# EasyEDA Pro project CheeseCake-BMI270-RV.epro

# Schematic BMI270-RV
Create Date: 2024-04-08; Page Name: BMI270; Project Name: 芝士蛋糕模块板; Schematic Name: BMI270-RV; Update Date: 2024-04-08; Company: Designed bg SoraKage; Page Size: A4; Version: V2.3
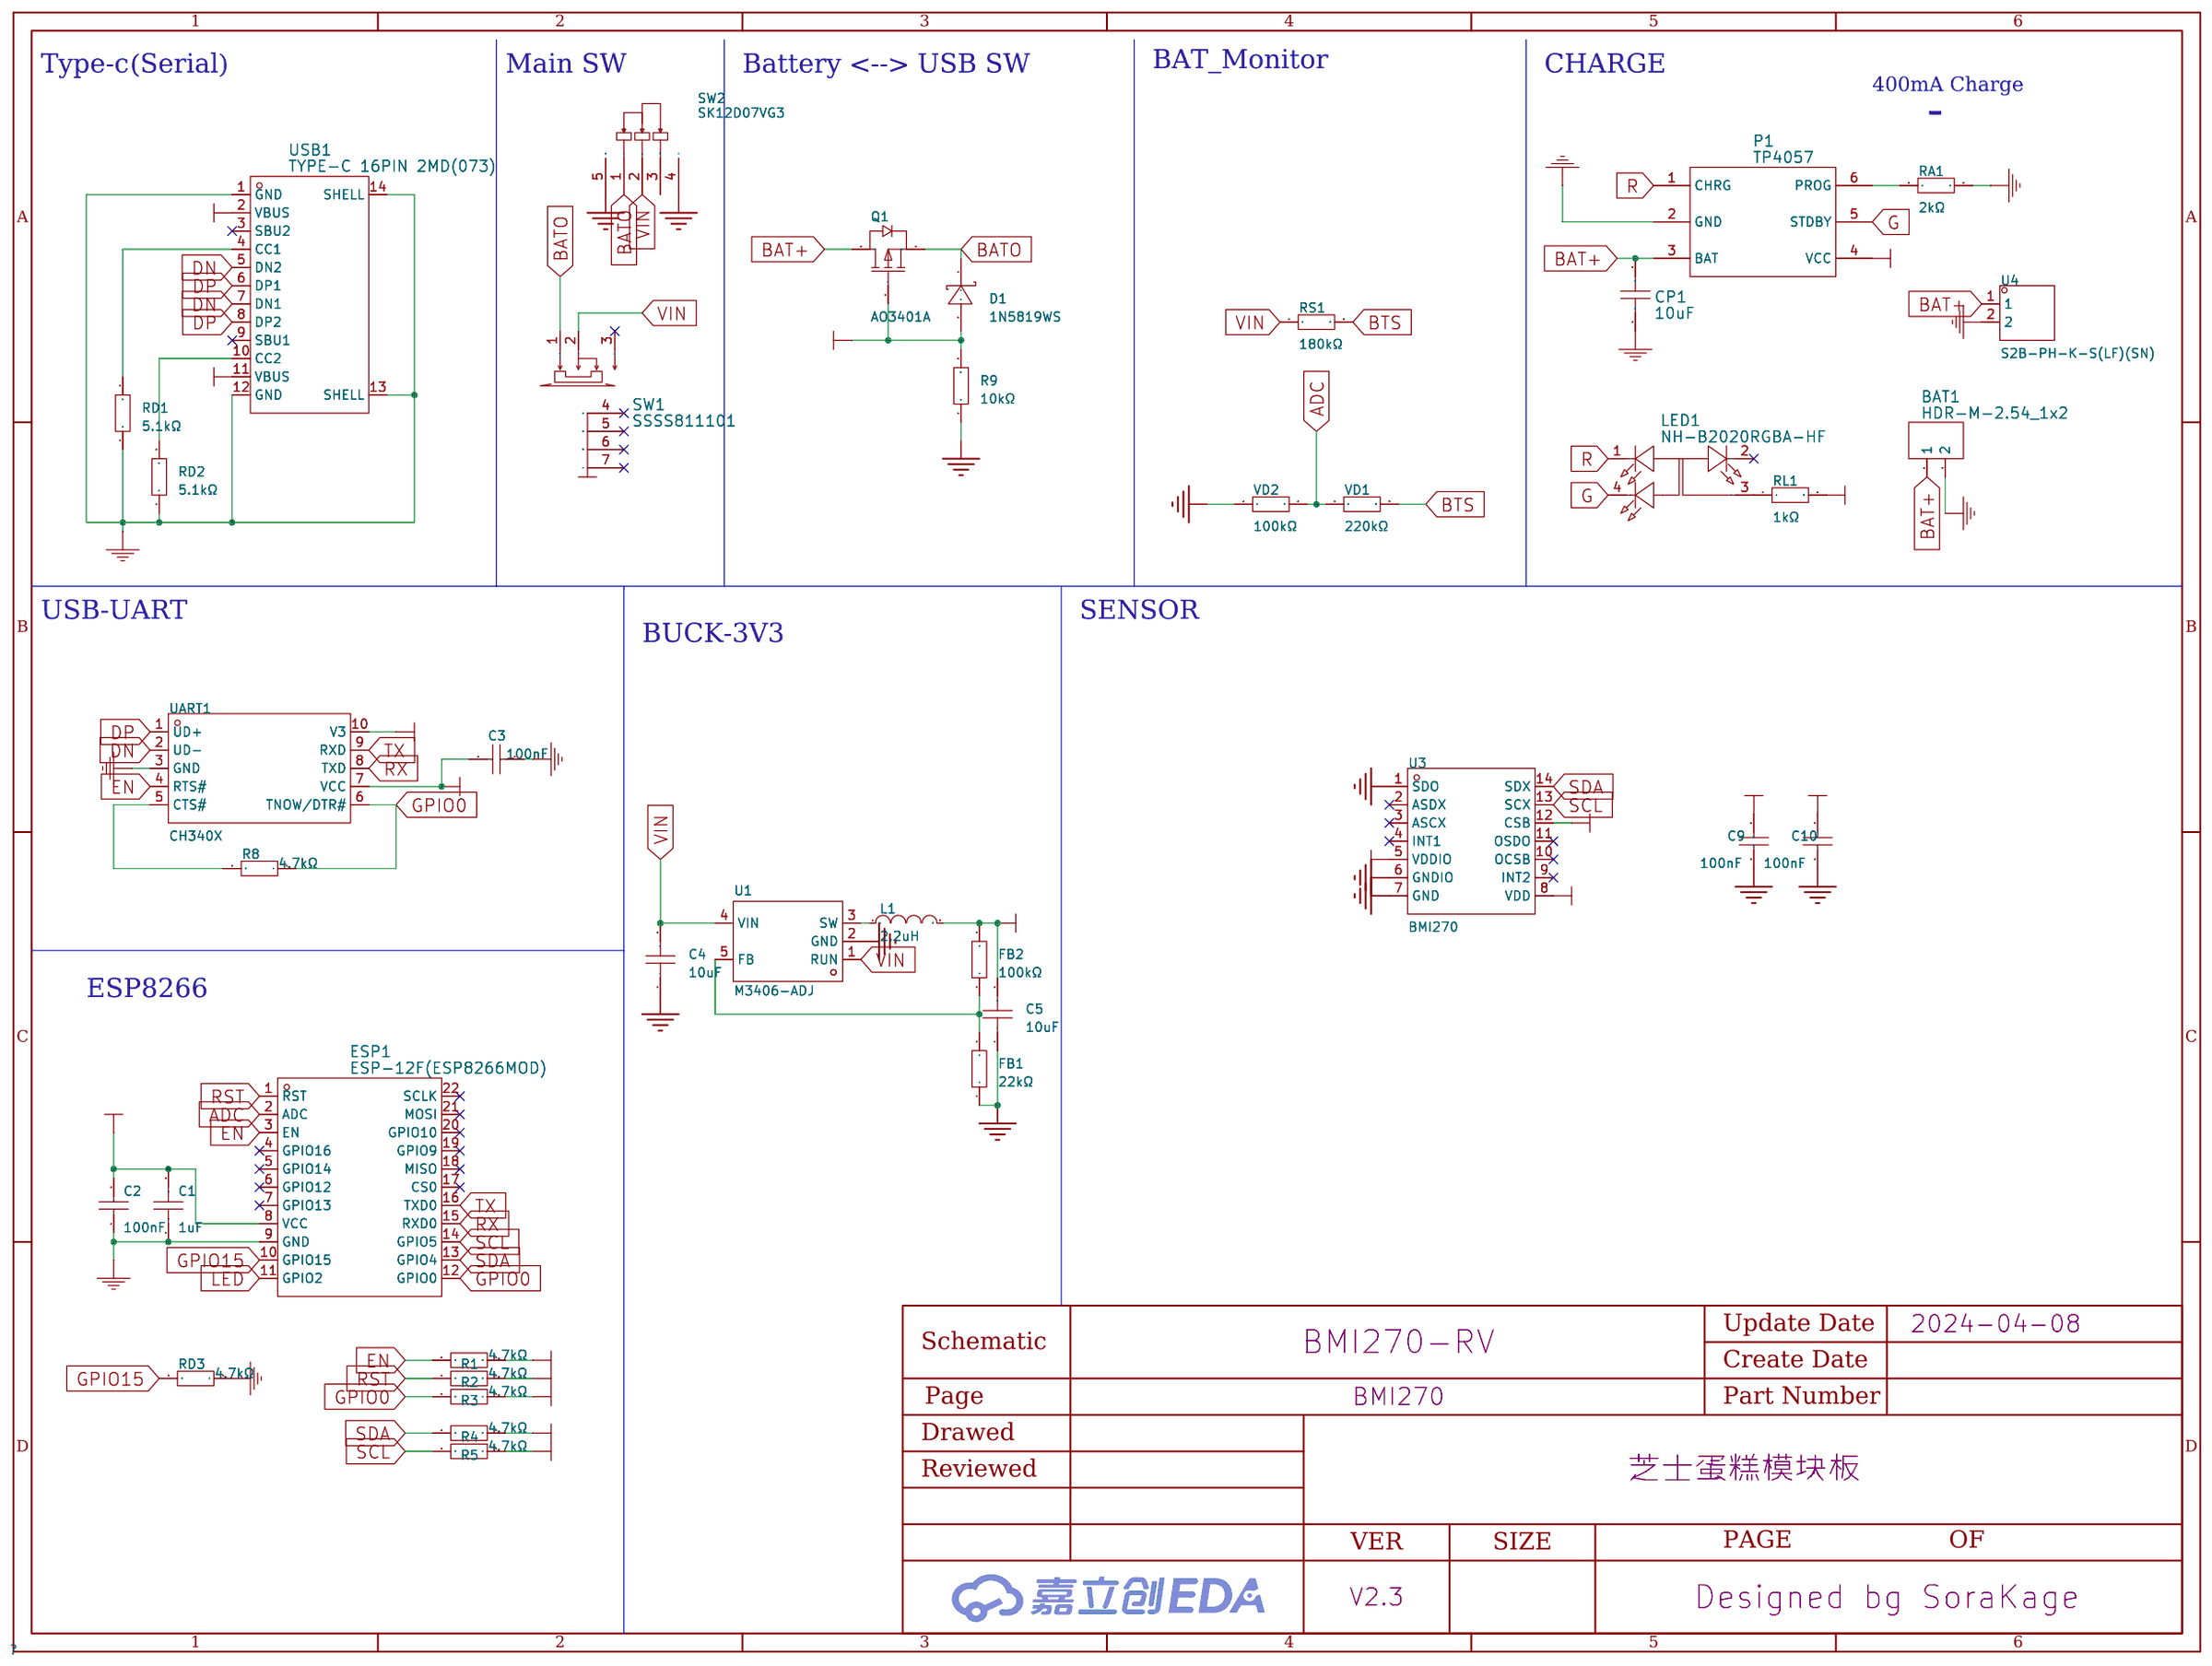
[diagram p0: schematic sheet]

## Parts
BAT1  HDR-M-2.54_1x2  [HDR-M-2.54_1X2]
C1  1uF  [C0402]
C2  100nF  [C0402]
C3  100nF  [C0402]
C4  10uF  [C0603]
C5  10uF  [C0603]
C9  100nF  [C0402]
C10  100nF  [C0402]
CP1  10uF  [C0603]
D1  1N5819WS  [SOD-323_L1.8-W1.3-LS2.5-RD]
ESP1  ESP-12F(ESP8266MOD)  [WIFIM-SMD_ESP-12F-ESP8266MOD]
FB1  22kΩ  [R0402]
FB2  100kΩ  [R0402]
L1  2.2uH  [IND-SMD_L2.5-W2.0_YXMBL252010P]
LED1  NH-B2020RGBA-HF  [LED-ARRAY-SMD_4P-L2.1-W2.1-TL_NH-B2020RGBA]
P1  TP4057  [SOT-23-6_L2.9-W1.6-P0.95-LS2.8-BL]
Q1  AO3401A  [SOT-23_L2.9-W1.3-P1.90-LS2.4-BR]
R1  4.7kΩ  [R0402]
R2  4.7kΩ  [R0402]
R3  4.7kΩ  [R0402]
R4  4.7kΩ  [R0402]
R5  4.7kΩ  [R0402]
R8  4.7kΩ  [R0402]
R9  10kΩ  [R0402]
RA1  2kΩ  [R0402]
RD1  5.1kΩ  [R0402]
RD2  5.1kΩ  [R0402]
RD3  4.7kΩ  [R0402]
RL1  1kΩ  [R0402]
RS1  180kΩ  [R0402]
SW1  SSSS811101  [SW-SMD_SSSS811101]
SW2  SK12D07VG3  [SW-TH_SK12D07VG3]
U1  M3406-ADJ  [SOT-23-5_L3.0-W1.7-P0.95-LS2.8-BR]
U3  BMI270  [LGA-14_L3.0-W2.5-P0.50-BR]
U4  S2B-PH-K-S(LF)(SN)  [CONN-TH_S2B-PH-K-S-LF-SN]
UART1  CH340X  [MSOP-10_L3.0-W3.0-P0.50-LS5.0-BL]
USB1  TYPE-C 16PIN 2MD(073)  [USB-C-SMD_TYPE-C-6PIN-2MD-073]
VD1  220kΩ  [R0402]
VD2  100kΩ  [R0402]

## Library data of the parts
BAT1 = HDR-M-2.54_1x2: Supplier Part: C124375; Supplier: LCSC
C1 = CL05A105KA5NQNC: 容值:1uF;精度:±10%;额定电压:25V;材质(温度系数):X5R;; LCSC Part Name: 1uF ±10% 25V; Supplier Part: C52923; Manufacturer: SAMSUNG(三星); Supplier Footprint: 0402; JLCPCB Part Class: 基础库; Datasheet: https://atta.szlcsc.com/upload/public/pdf/source/20160103/1457707735223.pdf; Supplier: LCSC; Tolerance: ±10%; Voltage Rated: 25V; Temperature Coefficient: X5R
C2 C3 C9 C10 = CL05B104KO5NNNC: 容值:100nF;精度:±10%;额定电压:16V;材质(温度系数):X7R;; LCSC Part Name: 100nF ±10% 16V; Supplier Part: C1525; Manufacturer: SAMSUNG(三星); Supplier Footprint: 0402; JLCPCB Part Class: Basic Part; Datasheet: https://atta.szlcsc.com/upload/public/pdf/source/20160103/1457707674891.pdf; Supplier: LCSC; Tolerance: ±10%; Voltage Rated: 16V; Temperature Coefficient: X7R
C4 C5 = CL10A106KP8NNNC: 容值:10uF;精度:±10%;额定电压:10V;材质(温度系数):X5R;; LCSC Part Name: 10uF ±10% 10V; Supplier Part: C19702; Manufacturer: SAMSUNG(三星); Supplier Footprint: 0603; JLCPCB Part Class: 基础库; Datasheet: https://atta.szlcsc.com/upload/public/pdf/source/20160103/1457707703378.pdf; Supplier: LCSC; Tolerance: ±10%; Voltage Rated: 10V; Temperature Coefficient: X5R
CP1 = 10uF: link: https://item.szlcsc.com/362304.html; 3DModel: C0603_L1.6-W0.8-H0.8; Supplier: LCSC; Manufacturer: SAMSUNG(三星); Manufacturer Part: CL10A106KP8NNNC; Supplier Part: C19702; JLCPCB Part Class: Basic Part
D1 = 1N5819WS_C191023: 直流反向耐压(Vr):40V;平均整流电流(Io):1A;正向压降(Vf):600mV@1A;; LCSC Part Name: 40V 1A 600mV@1A; Supplier Part: C191023; Manufacturer: Hottech(合科泰); Supplier Footprint: SOD-323; JLCPCB Part Class: 基础库; Datasheet: https://atta.szlcsc.com/upload/public/pdf/source/20220428/3CB86FD8D28D653594B4E35F9D5AEFD9.pdf; Supplier: LCSC; Reverse Voltage (Vr): 40V; Average Rectified Current (Io): 1A; Forward Voltage (Vf@If): 600mV@1A
ESP1 = ESP-12F(ESP8266MOD): Supplier: LCSC; Manufacturer: Ai-Thinker; Supplier Part: C82891; JLCPCB Part Class: Extended Part
FB1 = 0402WGF2202TCE: 电阻类型:厚膜电阻;阻值:22kΩ;精度:±1%;功率:62.5mW;; LCSC Part Name: 22kΩ ±1% 62.5mW; Supplier Part: C25768; Manufacturer: UNI-ROYAL(厚声); Supplier Footprint: 0402; JLCPCB Part Class: 基础库; Datasheet: https://atta.szlcsc.com/upload/public/pdf/source/20200306/C422600_1E6D84923E4A46A82E41ADD87F860B5C.pdf; Supplier: LCSC; Type: 厚膜电阻; Tolerance: ±1%; Power(Watts): 62.5mW; Temperature Coefficient: ±100ppm/℃; Overload Voltage (Max): 50V; Operating Temperature Range: -55℃~+155℃
FB2 VD2 = 0402WGF1003TCE: 电阻类型:厚膜电阻;阻值:100kΩ;精度:±1%;功率:62.5mW;; LCSC Part Name: 100kΩ ±1% 62.5mW; Supplier Part: C25741; Manufacturer: UNI-ROYAL(厚声); Supplier Footprint: 0402; JLCPCB Part Class: 基础库; Datasheet: https://atta.szlcsc.com/upload/public/pdf/source/20200306/C422600_1E6D84923E4A46A82E41ADD87F860B5C.pdf; Supplier: LCSC; Type: 厚膜电阻; Tolerance: ±1%; Power(Watts): 62.5mW; Temperature Coefficient: ±100ppm/℃; Overload Voltage (Max): 50V; Operating Temperature Range: -55℃~+155℃
L1 = APH252010T2R2M: 类型:一体成型电感;电感值:2.2uH;精度:±20%;额定电流:2.1A;饱和电流(Isat):3A;; LCSC Part Name: 2.2uH ±20% 3A; Supplier Part: C5349606; Manufacturer: APV(爱普微); Supplier Footprint: L252010; JLCPCB Part Class: 扩展库; Datasheet: https://atta.szlcsc.com/upload/public/pdf/source/20230112/CD71A991BF44148C80048C09E1A9BC6B.pdf; Supplier: LCSC; Type: 一体成型电感; Tolerance: ±20%; Rated Current: 2.1A; Saturation Current (Isat): 3A; DC Resistance (DCR): 70mΩ
LED1 = NH-B2020RGBA-HF: link: https://atta.szlcsc.com/upload/public/pdf/source/20210810/F2CC95523506BC87574AF0308E7F77A3.pdf; Supplier: LCSC; Supplier Part: C2874116; Manufacturer: 国星光电; JLCPCB Part Class: Extended Part
P1 = TP4057-42-SOT26-R: Supplier: LCSC; Manufacturer: TOPPOWER(南京拓微); Supplier Part: C12044; JLCPCB Part Class: Basic Part
Q1 = AO3401A_C15127: 类型:P沟道;漏源电压(Vdss):30V;连续漏极电流(Id):4A;功率(Pd):1.4W;导通电阻(RDS(on)@Vgs,Id):44mΩ@10V,4.3A;; LCSC Part Name: P沟道 30V 4A; Supplier Part: C15127; Manufacturer: AOS; Supplier Footprint: SOT-23-3L; JLCPCB Part Class: 基础库; Datasheet: https://atta.szlcsc.com/upload/public/pdf/source/20160507/1462613609053.pdf; Supplier: LCSC; Type: P沟道; Drain Source Voltage (Vdss): 30V; Continuous Drain Current (Id): 4A; Power Dissipation (Pd): 1.4W; Drain Source On Resistance (RDS(on)@Vgs,Id): 44mΩ@10V,4.3A; Gate Threshold Voltage (Vgs(th)@Id): 1.3V@250uA
R1-R5 R8 RD3 = 0402WGF4701TCE: 电阻类型:厚膜电阻;阻值:4.7kΩ;精度:±1%;功率:62.5mW;; LCSC Part Name: 4.7kΩ ±1% 62.5mW; Supplier Part: C25900; Manufacturer: UNI-ROYAL(厚声); Supplier Footprint: 0402; JLCPCB Part Class: 基础库; Datasheet: https://atta.szlcsc.com/upload/public/pdf/source/20200306/C422600_1E6D84923E4A46A82E41ADD87F860B5C.pdf; Supplier: LCSC; Type: 厚膜电阻; Tolerance: ±1%; Power(Watts): 62.5mW; Temperature Coefficient: ±100ppm/℃; Overload Voltage (Max): 50V; Operating Temperature Range: -55℃~+155℃
R9 = 0402WGF1002TCE: 电阻类型:厚膜电阻;阻值:10kΩ;精度:±1%;功率:62.5mW;; LCSC Part Name: 10kΩ ±1% 62.5mW; Supplier Part: C25744; Manufacturer: UNI-ROYAL(厚声); Supplier Footprint: 0402; JLCPCB Part Class: 基础库; Datasheet: https://atta.szlcsc.com/upload/public/pdf/source/20200306/C422600_1E6D84923E4A46A82E41ADD87F860B5C.pdf; Supplier: LCSC; Type: 厚膜电阻; Tolerance: ±1%; Power(Watts): 62.5mW; Temperature Coefficient: ±100ppm/℃; Overload Voltage (Max): 50V; Operating Temperature Range: -55℃~+155℃
RA1 = 0402WGF2001TCE: 电阻类型:厚膜电阻;阻值:2kΩ;精度:±1%;功率:62.5mW;; LCSC Part Name: 2kΩ ±1% 62.5mW; Supplier Part: C4109; Manufacturer: UNI-ROYAL(厚声); Supplier Footprint: 0402; JLCPCB Part Class: 基础库; Datasheet: https://atta.szlcsc.com/upload/public/pdf/source/20200306/C422600_1E6D84923E4A46A82E41ADD87F860B5C.pdf; Supplier: LCSC; Type: 厚膜电阻; Tolerance: ±1%; Power(Watts): 62.5mW; Temperature Coefficient: ±100ppm/℃; Overload Voltage (Max): 50V; Operating Temperature Range: -55℃~+155℃
RD1 RD2 = 0402WGF5101TCE: 电阻类型:厚膜电阻;阻值:5.1kΩ;精度:±1%;功率:62.5mW;; LCSC Part Name: 5.1kΩ ±1% 62.5mW; Supplier Part: C25905; Manufacturer: UNI-ROYAL(厚声); Supplier Footprint: 0402; JLCPCB Part Class: 基础库; Datasheet: https://atta.szlcsc.com/upload/public/pdf/source/20200306/C422600_1E6D84923E4A46A82E41ADD87F860B5C.pdf; Supplier: LCSC; Type: 厚膜电阻; Tolerance: ±1%; Power(Watts): 62.5mW; Temperature Coefficient: ±100ppm/℃; Overload Voltage (Max): 50V; Operating Temperature Range: -55℃~+155℃
RL1 = 0402WGF1001TCE: 电阻类型:厚膜电阻;阻值:1kΩ;精度:±1%;功率:62.5mW;; LCSC Part Name: 1kΩ ±1% 62.5mW; Supplier Part: C11702; Manufacturer: UNI-ROYAL(厚声); Supplier Footprint: 0402; JLCPCB Part Class: 基础库; Datasheet: https://atta.szlcsc.com/upload/public/pdf/source/20200306/C422600_1E6D84923E4A46A82E41ADD87F860B5C.pdf; Supplier: LCSC; Type: 厚膜电阻; Tolerance: ±1%; Power(Watts): 62.5mW; Temperature Coefficient: ±100ppm/℃; Overload Voltage (Max): 50V; Operating Temperature Range: -55℃~+155℃
RS1 = 0402WGF1803TCE: 阻值:180kΩ;精度:±1%;功率:62.5mW;温度系数:±100ppm/℃;电阻类型:厚膜电阻;; LCSC Part Name: 180kΩ ±1% 62.5mW 厚膜电阻; Supplier Part: C25760; Manufacturer: UNI-ROYAL(厚声); Supplier Footprint: 0402; JLCPCB Part Class: 扩展库; Datasheet: https://atta.szlcsc.com/upload/public/pdf/source/20200306/C422600_1E6D84923E4A46A82E41ADD87F860B5C.pdf; Supplier: LCSC; Tolerance: ±1%; Power(Watts): 62.5mW; Overload Voltage (Max): 50V; Temperature Coefficient: ±100ppm/℃; Type: 厚膜电阻; Operating Temperature Range: -55℃~+155℃
SW1 = SSSS811101: link: https://item.szlcsc.com/110556.html; 3DModel: SW-TH_SSSS811101; Supplier: LCSC; Manufacturer: ALPSALPINE(阿尔卑斯阿尔派); Supplier Part: C109335; JLCPCB Part Class: Extended Part
SW2 = SK12D07VG3: 电路结构:单刀双掷;安装方式:侧插;开关颜色:-;额定电流(DC):500mA;额定电压(DC):50V;额定电流(AC):-;额定电压(AC):-;机械寿命:5千次;; LCSC Part Name: 两档位卧式拨动开关,柄长3MM; Supplier Part: C431547; Manufacturer: SHOU HAN(首韩); Supplier Footprint: 插件; JLCPCB Part Class: 扩展库; Datasheet: https://atta.szlcsc.com/upload/public/pdf/source/20190925/C431547_01B93C6F3FA5C09E15F8CCBF4E6DB91A.pdf; Supplier: LCSC; Circuit: 单刀双掷; Pin Style: PC引脚; Switch Length: 8.7mm; Switch Width: 4.4mm; Switch Height: 4.7mm; Mounting Style: 侧插; Current Rating (DC): 500mA; Voltage Rating (DC): 50V; Mechanical Life: 5千次; Operating Temperature: -10℃~+50℃
U1 = M3406-ADJ: 功能类型:降压型;同步整流:-;输出通道数:-;拓扑结构:-;输入电压:-;输出电流(最大值):-;开关频率:-;; LCSC Part Name: 降压型; Supplier Part: C83224; Manufacturer: 西安航天民芯; Supplier Footprint: SOT-23-5; JLCPCB Part Class: 扩展库; Datasheet: https://atta.szlcsc.com/upload/public/pdf/source/20161110/1478742836232.pdf; Supplier: LCSC; Function: 降压型
U3 = BMI270: IMU-惯性测量单元; Supplier Part: C2836813; Manufacturer: Bosch(博世); Supplier Footprint: LGA-14(2.5x3); JLCPCB Part Class: 扩展库; Datasheet: https://atta.szlcsc.com/upload/public/pdf/source/20210625/C2836813_35E1F3F92097F45A3828DF13DDBA01A5.pdf; Supplier: LCSC
U4 = S2B-PH-K-S(LF)(SN): 插针结构:1x2P;间距:2mm;安装方式:弯插;参考系列:PH;总PIN数:2P;排数:1;每排PIN数:2;行距:-;触头材质:黄铜;; LCSC Part Name: 系列:PH 间距:2mm 1x2P; Supplier Part: C173752; Manufacturer: JST; Supplier Footprint: 弯插,P=2mm; JLCPCB Part Class: 扩展库; Datasheet: https://atta.szlcsc.com/upload/public/pdf/source/20181010/C265101_22107ACC4D8714694FDA2DD97145FA81.pdf; Supplier: LCSC; Pins Structure: 1x2P; Pitch: 2mm; Mounting Style: 弯插; Reference Series: PH; Number of Pins: 2P; Number of Rows: 1; Number of PINs Per Row: 2; Contact Material: 黄铜
UART1 = CH340X: Supplier Part: C3035748; Manufacturer: WCH(南京沁恒); Supplier Footprint: MSOP-10; JLCPCB Part Class: Extended Part; Supplier: LCSC
USB1 = TYPE-C 16PIN 2MD(073): link: https://atta.szlcsc.com/upload/public/pdf/source/20210409/C2765186_34D42616F62DF94D17C4D63D74D9FD03.pdf; Supplier: LCSC; Supplier Part: C2765186; Manufacturer: SHOU HAN(首韩); JLCPCB Part Class: Extended Part
VD1 = 0402WGF2203TCE: 电阻类型:厚膜电阻;阻值:220kΩ;精度:±1%;功率:62.5mW;; LCSC Part Name: 220kΩ ±1% 62.5mW; Supplier Part: C25767; Manufacturer: UNI-ROYAL(厚声); Supplier Footprint: 0402; JLCPCB Part Class: 基础库; Datasheet: https://atta.szlcsc.com/upload/public/pdf/source/20200306/C422600_1E6D84923E4A46A82E41ADD87F860B5C.pdf; Supplier: LCSC; Type: 厚膜电阻; Tolerance: ±1%; Power(Watts): 62.5mW; Temperature Coefficient: ±100ppm/℃; Overload Voltage (Max): 50V; Operating Temperature Range: -55℃~+155℃

## Nets
3V3: C1.2 C2.2 C3.2 C5.2 C9.1 C10.1 ESP1.8(VCC) FB2.2 L1.2 R1.1 R2.1 R3.1 R4.1 R5.1 U3.5(VDDIO) U3.8(VDD) U3.12(CSB) UART1.7(VCC) UART1.10(V3)
+5V: D1.2(A) P1.4(VCC) Q1.1(G) R9.2 RL1.2 USB1.2(VBUS) USB1.11(VBUS)
GND: BAT1.2 C1.1 C2.1 C3.1 C4.1 C5.1 C9.2 C10.2 CP1.1 ESP1.9(GND) FB1.1 P1.2(GND) R9.1 RA1.2 RD1.1 RD2.1 RD3.1 SW2.4 SW2.5 U1.2(GND) U3.1(SDO) U3.6(GNDIO) U3.7(GND) U4.2 UART1.3(GND) USB1.1(GND) USB1.12(GND) USB1.13(SHELL) USB1.14(SHELL) VD2.1
VIN: C4.2 RS1.1 SW1.2 SW2.2 U1.1(RUN) U1.4(VIN)
ADC: ESP1.2(ADC) VD1.1 VD2.2
BAT+: BAT1.1 CP1.2 P1.3(BAT) Q1.3(D) U4.1
BATO: D1.1(K) Q1.2(S) SW1.1 SW2.1
BTS: RS1.2 VD1.2
DN: UART1.2(UD-) USB1.5(DN2) USB1.7(DN1)
DP: UART1.1(UD+) USB1.6(DP1) USB1.8(DP2)
EN: ESP1.3(EN) R1.2 UART1.4(RTS#)
G: LED1.4(-) P1.5(STDBY)
GPIO0: ESP1.12(GPIO0) R3.2 R8.1 UART1.6(TNOW/DTR#)
GPIO15: ESP1.10(GPIO15) RD3.2
LED: ESP1.11(GPIO2)
R: LED1.1(-) P1.1(CHRG)
RST: ESP1.1(RST) R2.2
RX: ESP1.15(RXD0) UART1.8(TXD)
SCL: ESP1.14(GPIO5) R5.2 U3.13(SCX)
SDA: ESP1.13(GPIO4) R4.2 U3.14(SDX)
TX: ESP1.16(TXD0) UART1.9(RXD)
$1N2030: RD1.2 USB1.4(CC1)
$1N2031: RD2.2 USB1.10(CC2)
$1N2038: P1.6(PROG) RA1.1
$1N5947: L1.1 U1.3(SW)
$1N5953: FB1.2 FB2.1 U1.5(FB)
$1N6173: R8.2 UART1.5(CTS#)
$1N9979: LED1.3(+) RL1.1

Not connected (* = marked no-connect by the designer): ESP1 4(GPIO16)* 5(GPIO14)* 6(GPIO12)* 7(GPIO13)* 17(CS0)* 18(MISO)* 19(GPIO9)* 20(GPIO10)* 21(MOSI)* 22(SCLK)*; LED1 2(-)*; SW1 3* 4* 5* 6* 7*; SW2 3; U3 2(ASDX)* 3(ASCX)* 4(INT1)* 9(INT2)* 10(OCSB)* 11(OSDO)*; USB1 3(SBU2)* 9(SBU1)*

## Notes on the sheet
- Type-c(Serial)
- Main SW
- Battery <--> USB SW
- BAT_Monitor
- CHARGE
- 400mA Charge
- -
- USB-UART
- SENSOR
- BUCK-3V3
- ESP8266

# Board BMI270-RV
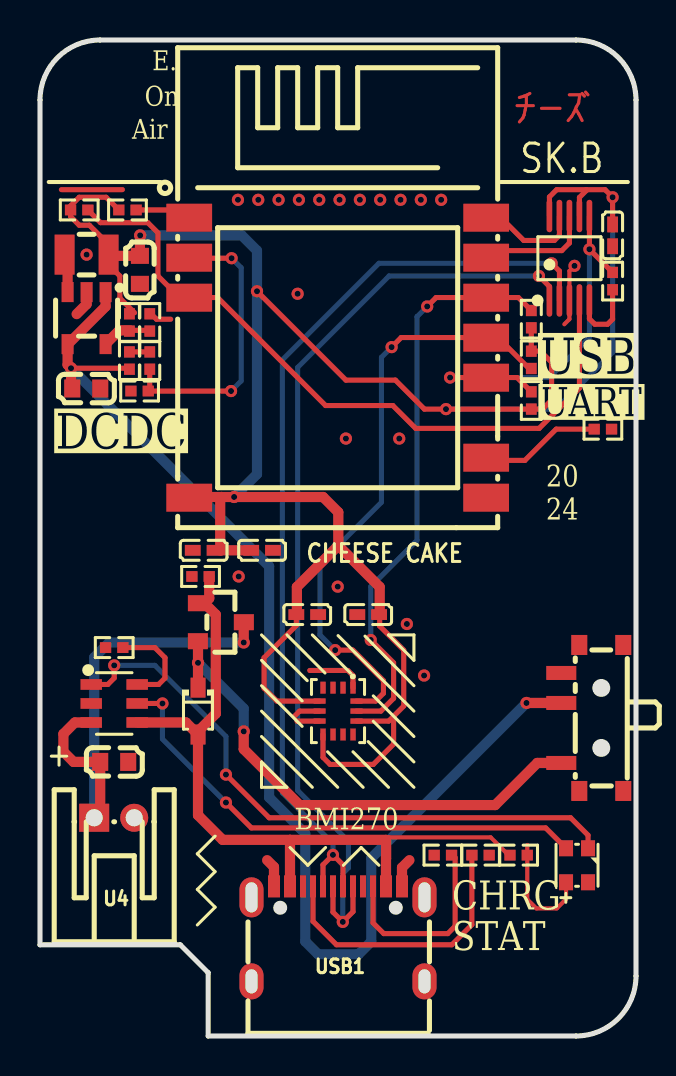
[diagram p1: board, top side]
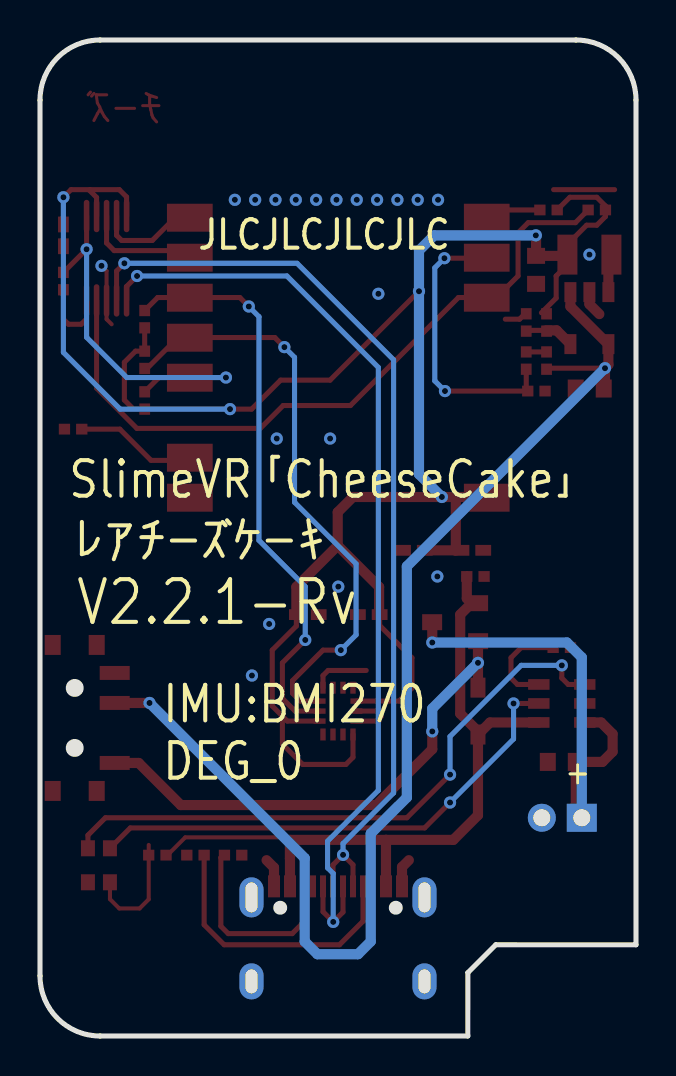
[diagram p2: board, bottom side, seen from below]

Outline 29.8 x 49.8 mm; copper layers: Top Layer, Bottom Layer. Coordinates in mm from the lower left corner of the outline.
Outline path: 0,4.56 0,46.8 arc(0.88,48.92) 3,49.8 26.8,49.8 arc(28.92,48.92) 29.8,46.8 29.8,3 arc(28.92,0.88) 26.8,0 8.41,0 8.41,3.16 7.01,4.56 0,4.56
Stack: Top Layer 0.035mm / Dielectric1 0.91mm FR4 er 4.5 / Bottom Layer 0.035mm

## Design rules (mm)
spacing Default (default): track to track 0.127, other pairs 0 to 0.127
track width Default (default): min 0.127, default 0.127, max 25.4
differential pair differentialPair (default): width min 0.127, default 0.254, max 2.54; gap min 0.152, default 0.152
via Default (default): diameter min 0.61, default 0.61, max 100.025; hole min 0.305, default 0.305, max 59.995
net GND uses gge20888(1)

## Placement (name value [footprint] x y rotation side)
C1  1uF  [C0402]  8.18 24.28 0 top
C2  100nF  [C0402]  11.1 24.28 180 top
C3  100nF  [C0402]  28.63 40.03 90 top
C4  10uF  [C0603]  2.31 32.37 180 top
C5  10uF  [C0603]  5 38.31 90 top
C9  100nF  [C0402]  16.41 21.07 180 top
C10  100nF  [C0402]  13.36 21.07 0 top
CP1  10uF  [C0603]  3.71 13.71 180 top
D1  1N5819WS  [SOD-323_L1.8-W1.3-LS2.5-RD]  7.9 16.25 270 top
ESP1  ESP-12F(ESP8266MOD)  [WIFIM-SMD_ESP-12F-ESP8266MOD]  14.89 33.26 270 top
FB1  22kΩ  [R0402]  5.49 35.68 270 top
FB2  100kΩ  [R0402]  4.47 35.68 90 top
L1  2.2uH  [IND-SMD_L2.5-W2.0_YXMBL252010P]  2.33 39.07 180 top
LED1  NH-B2020RGBA-HF  [LED-ARRAY-SMD_4P-L2.1-W2.1-TL_NH-B2020RGBA]  26.85 8.54 270 top
P1  TP4057  [SOT-23-6_L2.9-W1.6-P0.95-LS2.8-BL]  3.71 16.63 270 top
Q1  AO3401A  [SOT-23_L2.9-W1.3-P1.90-LS2.4-BR]  9.04 20.69 180 top
R1  4.7kΩ  [R0402]  1.96 41.3 0 top
R2  4.7kΩ  [R0402]  4.37 41.3 0 top
R3  4.7kΩ  [R0402]  24.57 31.78 90 top
R4  4.7kΩ  [R0402]  24.57 33.81 270 top
R5  4.7kΩ  [R0402]  24.57 35.84 90 top
R8  4.7kΩ  [R0402]  28.63 37.75 270 top
R9  10kΩ  [R0402]  8.03 22.98 0 top
RA1  2kΩ  [R0402]  3.71 19.42 180 top
RD1  5.1kΩ  [R0402]  22.03 9.04 180 top
RD2  5.1kΩ  [R0402]  20.14 9.04 0 top
RD3  4.7kΩ  [R0402]  28.15 30.34 180 top
RL1  1kΩ  [R0402]  23.93 9.04 180 top
RS1  180kΩ  [R0402]  4.47 33.77 90 top
SW1  SSSS811101  [SW-SMD_SSSS811101]  27.61 15.9 90 top
U1  M3406-ADJ  [SOT-23-5_L3.0-W1.7-P0.95-LS2.8-BR]  2.33 35.89 90 top
U3  BMI270  [LGA-14_L3.0-W2.5-P0.50-BR]  14.9 16.25 90 top
U4  S2B-PH-K-S(LF)(SN)  [CONN-TH_S2B-PH-K-S-LF-SN]  3.71 10.91 180 top
UART1  CH340X  [MSOP-10_L3.0-W3.0-P0.50-LS5.0-BL]  26.47 38.89 0 top
USB1  TYPE-C 16PIN 2MD(073)  [USB-C-SMD_TYPE-C-6PIN-2MD-073]  14.9 5.11 0 top
VD1  220kΩ  [R0402]  5.49 33.77 90 top
VD2  100kΩ  [R0402]  4.98 32.25 0 top

## Footprints (pads in the part's own frame, mm; a bottom-side part is the same pattern mirrored in y, then rotated)
C0402
  rect 0.79x0.54 smd: 1(-0.545,0) 2(0.545,0)
C0603
  rect 0.8x0.9 smd: 1(-0.7,0) 2(0.7,0)
CONN-TH_S2B-PH-K-S-LF-SN
  rect 1.5x1.4 hole 0.85: 1(1,0)
  round 1.4 hole 0.85: 2(-1,0)
IND-SMD_L2.5-W2.0_YXMBL252010P
  rect 1x2 smd: 1(1.1,0) 2(-1.1,0)
LED-ARRAY-SMD_4P-L2.1-W2.1-TL_NH-B2020RGBA
  rect 0.8x0.7 smd: 1(-0.85,0.55) 2(0.85,0.55) 3(0.85,-0.55) 4(-0.85,-0.55)
LGA-14_L3.0-W2.5-P0.50-BR
  rect 0.6x0.27 smd: 1(1.17,-0.75) 2(1.17,-0.25) 3(1.17,0.25) 4(1.17,0.75) 8(-1.17,0.75) 9(-1.17,0.25) 10(-1.17,-0.25) 11(-1.17,-0.75)
  rect 0.27x0.6 smd: 5(0.5,0.92) 6(0,0.92) 7(-0.5,0.92) 12(-0.5,-0.92) 13(0,-0.92) 14(0.5,-0.92)
MSOP-10_L3.0-W3.0-P0.50-LS5.0-BL
  oval 0.28x1.62 smd: 1(-1,-2.11) 2(-0.5,-2.11) 3(0,-2.11) 4(0.5,-2.11) 5(1,-2.11) 6(1,2.11) 7(0.5,2.11) 8(0,2.11) 9(-0.5,2.11) 10(-1,2.11)
R0402
  rect 0.566x0.54 smd: 1(-0.433,0) 2(0.433,0)
SOD-323_L1.8-W1.3-LS2.5-RD
  rect 1x0.75 smd: 1(-1.173,0) 2(1.173,0)
SOT-23-5_L3.0-W1.7-P0.95-LS2.8-BR
  rect 1x0.6 smd: 1(1.3,-0.95) 2(1.3,0) 3(1.3,0.95) 4(-1.3,0.95) 5(-1.3,-0.95)
SOT-23-6_L2.9-W1.6-P0.95-LS2.8-BL
  rect 0.532x1.072 smd: 1(-0.95,-1.149) 2(0,-1.149) 3(0.95,-1.149) 4(0.95,1.149) 5(0,1.149) 6(-0.95,1.149)
SOT-23_L2.9-W1.3-P1.90-LS2.4-BR
  rect 1x0.8 smd: 1(1.15,-0.95) 2(1.15,0.95) 3(-1.15,0)
SW-SMD_SSSS811101
  rect 0.7x1.5 smd: 1(-2.25,1.55) 2(0.75,1.55) 3(2.25,1.55)
  rect 1x0.8 smd: 4(-3.65,0.65) 5(3.65,0.65) 6(3.65,-1.55) 7(-3.65,-1.55)
USB-C-SMD_TYPE-C-6PIN-2MD-073
  rect 0.6x1.1 smd: 1(-3.2,2.375) 2(-2.4,2.375) 11(2.4,2.375) 12(3.2,2.375)
  rect 0.3x1.1 smd: 3(-1.75,2.375) 4(-1.25,2.375) 5(-0.75,2.375) 6(-0.25,2.375) 7(0.25,2.375) 8(0.75,2.375) 9(1.25,2.375) 10(1.75,2.375)
  oval 1.2x2 hole 0.6x1.5: 13(-4.325,1.825) 14(4.325,1.825)
  oval 1.2x1.8 hole 0.6x1.2: 15(-4.325,-2.375) 16(4.325,-2.375)
WIFIM-SMD_ESP-12F-ESP8266MOD
  rect 1.397x2.286 smd: 1(-7.651,-7.425) 2(-5.651,-7.425) 3(-3.651,-7.425) 8(6.349,-7.423) 9(6.349,7.421) 10(4.349,7.423) 12(0.349,7.423) 13(-1.651,7.423) 14(-3.651,7.423) 15(-5.651,7.423) 16(-7.651,7.423)

## Nets
As in the schematic, except:
GND: C1.1 C2.1 C3.1 C4.1 C5.1 C9.2 C10.2 CP1.1 ESP1.9 FB1.1 P1.2 R9.1 RA1.2 RD1.1 RD2.1 RD3.1 U1.2 U3.1 U3.6 U3.7 U4.2 UART1.3 USB1.1 USB1.12 USB1.13 USB1.14 USB1.15 USB1.16 VD2.1

Pads without a net: LED1 2; SW1 3 4 5 6 7; U3 2 3 4 9 10 11; USB1 3 9

## Via types
v1: diameter 0.61, hole 0.305, Top Layer to Bottom Layer, 46 vias

## Routing (per net, layer and track width the routed paths; a pad name or vN(x,y) marks a point on that pad's centre or on a via; arc(x,y) is an arc through that point)
3V3: length 121.5
  Top Layer w0.254: 16.96,21.07 16.98,21.04 16.98,20.5 18.19,19.29 18.19,16.5 17.68,15.99 ; 17.68,15.99 17.68,14.59 16.66,13.58 14.5,13.58 14.15,13.93 U3.8 ; 17.68,15.99 17.43,15.75 15.82,15.75 ; 27.3,42.32 25.84,42.32 25.47,41.95 UART1.10 ; 27.3,42.32 27.33,42.29 26.97,41.93 UART1.7 ; 27.3,42.32 28.25,42.32 v1(28.63,41.94) C3.2 ; R5.1 R4.1 25.02,34.24 25.58,33.68 25.58,31.8 25.13,31.34 R3.1 v1(20.3,31.34) 19.22,31.34 17.77,32.79 15.3,32.79 v1(10.85,37.24) ; 4.73,36.16 3.99,36.89 3.99,38 3.49,38.5 3.49,39.01 ; R2.1 3.31,41.94 1.96,41.94 1.53,41.5 R1.1 1.53,40.97 1.96,40.54 2.47,40.54 3.43,39.58 L1.2 ; C10.1 12.82,20.53 11.2,18.91 11.2,17.39 11.85,16.75 13.98,16.75
  Top Layer w0.508: 14.91,24.52 14.91,26.19 14.15,26.95 v1(9.71,26.95) 9.07,26.95 ; 14.91,24.52 12.84,22.45 12.84,21.1 C10.1 ; 14.91,24.52 16.98,22.45 16.98,21.1 16.96,21.07 ; 9.07,26.95 9.01,26.89 9.01,24.28 10.4,24.28 ; 9.07,26.95 7.45,26.95 7.42,26.92 ; L1.2 3.49,39.01 C5.2 5,40.02 v1(5.01,40.03)
  Bottom Layer w0.254: v1(20.3,31.34) 25.79,31.34 28.63,34.18 v1(28.63,41.94)
  Bottom Layer w0.508: v1(9.71,26.95) 10.85,28.09 v1(10.85,37.24) 10.85,39.27 10.09,40.03 v1(5.01,40.03)
+5V: length 38.7
  Top Layer w0.203: RL1.2 23.42,9.04 22.53,9.93 17.45,9.93 17.45,8.86 17.3,8.86
  Top Layer w0.508: 8.22,21.64 8.79,21.07 8.79,16.12 7.9,15.23 D1.2 ; 8.22,21.64 Q1.1 ; 8.22,21.64 8.46,21.88 R9.2 ; 12.5,9.81 12.5,7.35 ; 12.5,9.81 9.13,9.81 7.9,11.04 D1.2 ; 12.5,9.81 17.3,9.81 17.3,7.35 ; D1.2 7.3,15.68 P1.4
GND: length 17.2
  Top Layer w0.203: 26.22,35.59 26.47,35.84 UART1.3 26.47,38.25 v1(26.73,38.51)
  Top Layer w0.254: 4.12,42.32 1.07,42.32 ; 13.98,16.25 12.98,16.25 12.73,15.99 ; U3.1 15.65,18.02 15.39,18.28 13.49,18.28 ; 6.53,35.84 5.82,35.84 5.52,36.15 ; 12.85,15.74 12.86,15.75 13.98,15.75
  Top Layer w0.508: 11.7,7.35 11.7,8.45 11.36,8.79 ; 18.47,8.79 18.1,8.42 18.1,7.35 ; U1.2 2.33,36.59 1.83,36.09
  vias: v1(2.33,39.07) v1(9.9,41.81) v1(9.93,22.98) v1(10.91,41.81) v1(11.93,41.81) v1(12.95,41.81) v1(12.88,37.11) v1(13.96,41.81) v1(14.89,22.47) v1(14.98,41.81) v1(15.3,29.87) v1(15.99,41.81) v1(17.01,41.81) v1(18.03,41.81) v1(17.96,29.87) v1(18.34,20.6) v1(19.04,41.81) v1(19.2,18.02) v1(20.06,41.81)
VIN: length 62.8
  Top Layer w0.254: RS1.1 4.42,33.39 v1(1.55,33.39)
  Top Layer w0.508: 24.31,16.66 v1(24.32,16.65) SW1.2 ; U1.1 3.28,36.48 1.4,34.59 U1.4 1.38,33.56 v1(1.55,33.39) 1.55,32.56 1.61,32.5
  Bottom Layer w0.508: v1(1.55,33.39) 11.46,23.48 11.46,11.93 13.26,10.12 13.26,4.73 13.9,4.09 15.93,4.09 16.57,4.73 16.57,8.89 v1(24.32,16.65)
ADC: length 14.5
  Top Layer w0.254: 7.42,38.92 7.46,38.89 v1(9.58,38.89) ; v1(9.55,32.25) VD2.2 5.49,32.32 VD1.1
  Bottom Layer w0.254: v1(9.58,38.89) 10.06,38.41 10.06,32.76 v1(9.55,32.25)
BAT+: length 24.3
  Top Layer w0.508: Q1.3 10.19,20.68 v1(10.19,19.67) ; P1.3 1.74,15.68 1.17,15.1 1.17,14.21 1.68,13.71 CP1.2 3.01,11.21 U4.1
  Bottom Layer w0.508: 2.71,10.93 U4.1 2.71,18.93 3.46,19.67 v1(10.19,19.67)
BATO: length 25.4
  Top Layer w0.508: v1(10.19,15.23) 10.19,14.34 12.98,11.55 22.76,11.55 24.87,13.65 SW1.1 ; 7.9,17.54 v1(7.9,18.66) 7.9,19.73 Q1.2
  Bottom Layer w0.508: v1(7.9,18.66) 10.19,16.37 v1(10.19,15.23)
BTS: length 1
  Top Layer w0.254: RS1.2 VD1.2
DN: length 47.1
  Top Layer w0.254: 14.15,7.35 14.15,8.56 v1(14.65,9.06) 15.15,8.55 15.15,7.35 ; UART1.2 25.97,38.25 v1(25.58,38.63)
  Bottom Layer w0.254: v1(25.58,38.63) 16.95,38.63 12.12,33.81 12.12,12.15 14.65,9.63 v1(14.65,9.06)
DP: length 48
  Top Layer w0.254: UART1.1 25.47,37.48 v1(24.95,38) ; 14.65,7.35 14.65,6.19 v1(15.14,5.7) 15.65,6.21 15.65,7.35
  Bottom Layer w0.254: v1(15.14,5.7) 15.14,8.13 15.42,8.41 15.42,9.74 12.88,12.28 12.88,33.43 17.45,38 v1(24.95,38)
EN: length 35.6
  Top Layer w0.254: 2.39,41.3 3.03,40.67 5.39,40.67 5.9,40.16 5.9,38 6.98,36.92 8.88,36.92 14.28,31.52 17.64,31.52 18.79,30.38 24.96,30.38 26.97,32.39 UART1.4
G: length 25.5
  Top Layer w0.254: LED1.4 25.28,10.4 10.57,10.4 v1(9.3,11.67) ; P1.5 v1(6.12,16.63)
  Bottom Layer w0.254: v1(6.12,16.63) 6.12,14.85 v1(9.3,11.67)
GPIO0: length 19.9
  Top Layer w0.254: UART1.6 v1(27.47,39.34) R8.1 ; R3.2 23.85,32.92 v1(20.5,32.92)
  Bottom Layer w0.254: v1(27.47,39.34) 27.47,34.94 25.46,32.92 v1(20.5,32.92)
GPIO15: length 5.9
  Top Layer w0.254: RD3.2 25.81,30.34 24.25,28.78 22.66,28.78 22.52,28.92
R: length 30.9
  Top Layer w0.254: LED1.1 27.4,10.04 26.53,10.91 11.46,10.91 v1(9.3,13.07) ; v1(3.71,18.53) 3.71,17.9 3.39,17.58 P1.1
  Bottom Layer w0.254: v1(9.3,13.07) 9.3,14.98 5.74,18.53 v1(3.71,18.53)
RST: length 2.8
  Top Layer w0.254: 7.42,40.92 7.04,41.3 R2.2
RX: length 5.6
  Top Layer w0.254: UART1.8 26.47,39.65 26.09,39.27 22.87,39.27 22.52,38.92
SCL: length 29
  Top Layer w0.254: 15.82,16.25 17.05,16.25 17.68,16.88 17.68,18.66 v1(16.54,19.8) ; v1(19.36,36.48) 19.81,36.92 23.92,36.92 R5.2
  Bottom Layer w0.254: v1(19.36,36.48) 18.85,35.97 18.85,24.78 16.54,22.47 v1(16.54,19.8)
SDA: length 30
  Top Layer w0.254: 15.82,16.75 16.78,16.75 17.17,17.13 17.17,17.77 15.65,19.29 v1(14.76,19.29) ; R4.2 24.45,33.38 22.9,34.92 18.06,34.92 v1(17.58,34.44)
  Bottom Layer w0.254: v1(14.76,19.29) 14,20.06 14,23.61 17.07,26.69 17.07,33.94 v1(17.58,34.44)
TX: length 5
  Top Layer w0.254: 22.52,40.92 23.04,40.92 24.19,39.78 25.72,39.78 25.97,40.03 UART1.9
$1N2030: length 13.9
  Top Layer w0.254: 13.65,7.35 13.65,5.74 14.83,4.56 20.59,4.56 21.59,5.56 RD1.2
$1N2031: length 9.9
  Top Layer w0.254: 16.65,7.35 16.65,5.66 17.19,5.12 20.39,5.12 20.76,5.49 20.76,8.92 20.58,9.1
$1N2038: length 4.9
  Top Layer w0.254: P1.6 5.93,17.58 6.25,17.9 6.25,18.91 5.74,19.42 RA1.1
$1N5947: length 1.9
  Top Layer w0.508: L1.1 1.38,38.92 U1.3
$1N5953: length 2.5
  Top Layer w0.254: 5.52,35.28 4.5,35.28
  Top Layer w0.508: 4.5,35.28 3.97,35.28 U1.5
$1N6173: length 3.8
  Top Layer w0.254: UART1.5 27.47,35.86 27.74,35.59 28.38,35.59 28.63,35.84 R8.2
$1N9979: length 5.9
  Top Layer w0.203: LED1.3 26.3,6.84 25.84,6.38 24.82,6.38 24.36,6.83 RL1.1 24.36,9.55

## Copper pours and planes (outline as drawn; the poured copper is in the pictures)
GND on Top Layer: -1.12,53.71 30.51,53.71 30.51,-9.79 -1.12,-9.79
GND on Bottom Layer: -15.47,51.17 31.02,51.17 31.02,-0.77 -15.47,-0.77

## Text on the board
Bottom Silkscreen Layer: + | JLCJLCJLCJLC | IMU:BMI270 / DEG_0 | V2.2.1-Rv | レアチーズケーキ | SlimeVR「CheeseCake」
Document Layer: Y | TP4057:2K | Some pins on ESP-12F was removed due to easy wiring | AD0=L / IIC ADDR=0X68
Top Layer: チーズ
Top Solder Mask Layer: 400mA | 5V | 2024LMT | - | ▲
Top Silkscreen Layer: CHEESE CAKE | + | SK.B | Air | On | E. | BMI270 | CHRG | STAT | UART | DCDC | USB | 20 | 24
